# EAGLE design temperature_sensor (EAGLE 9.3.0)
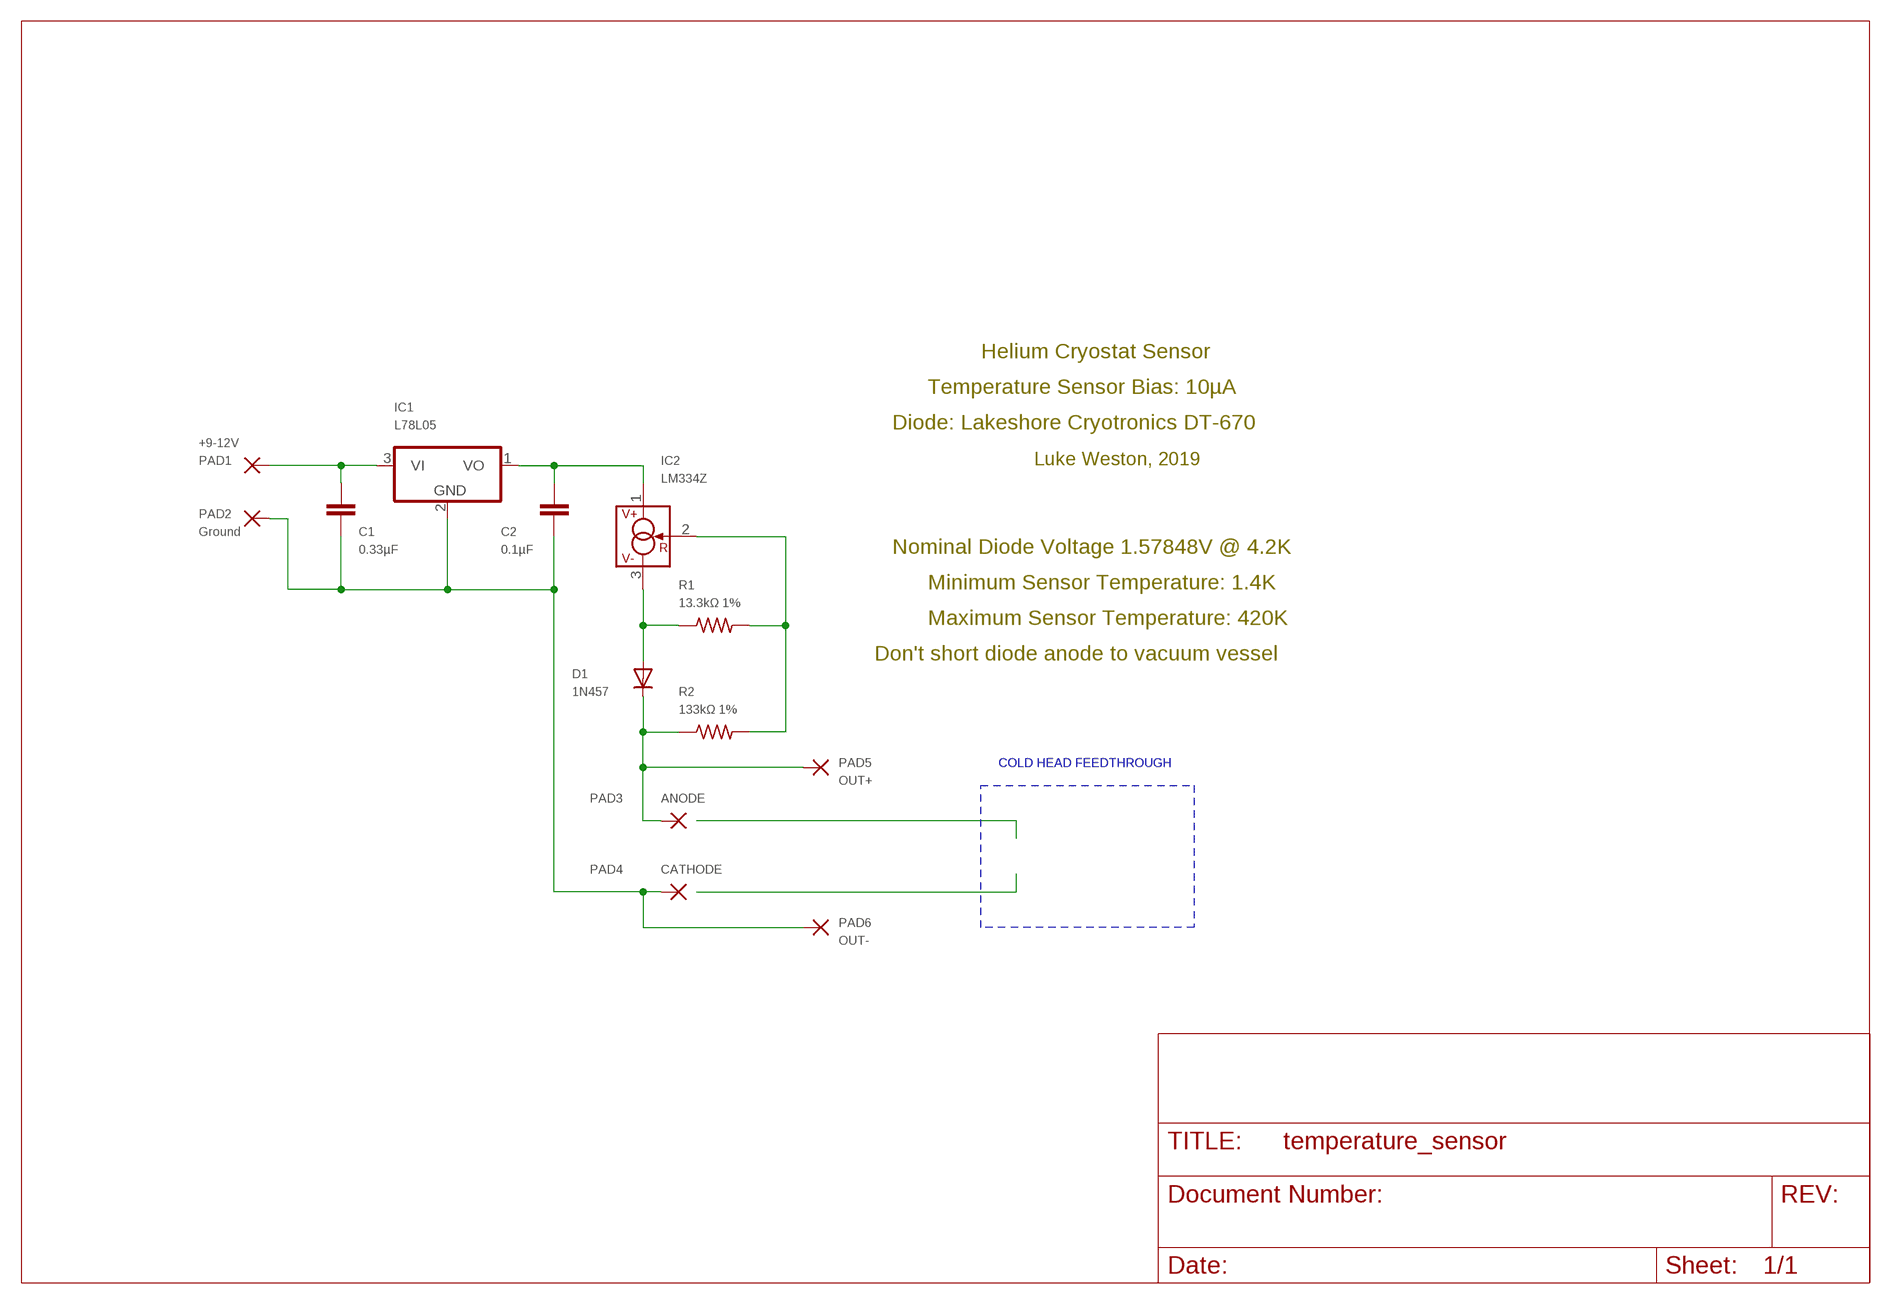
[diagram p0: schematic, sheet 1]

## Parts
C1  0.33µF  C-EU050-024X044  [C050-024X044]
C2  0.1µF  C-EU050-024X044  [C050-024X044]
D1  1N457  1N4004  [DO41-10]
IC1  L78L05  78L05Z  [TO92]
IC2  LM334Z  [TO92]
PAD1  +9-12V  2,54/1,0  [2,54/1,0]
PAD2  Ground  2,54/1,0  [2,54/1,0]
PAD3  ANODE  2,54/1,0  [2,54/1,0]
PAD4  CATHODE  2,54/1,0  [2,54/1,0]
PAD5  OUT+  2,54/1,0  [2,54/1,0]
PAD6  OUT-  2,54/1,0  [2,54/1,0]
R1  13.3kΩ 1%  R-US_0207/10  [0207/10]
R2  133kΩ 1%  R-US_0207/10  [0207/10]

## Nets
GND: C1.2 C2.2 IC1.2(GND) PAD2.1(P) PAD4.1(P) PAD6.1(P)
N$1: C1.1 IC1.3(VI) PAD1.1(P)
N$2: C2.1 IC1.1(VO) IC2.1(V+)
N$3: D1.C PAD3.1(P) PAD5.1(P) R2.1
N$4: D1.A IC2.3(V-) R1.1
N$5: IC2.2(R) R1.2 R2.2

## Buses
B$1

## Notes on the sheet
- Helium Cryostat Sensor
- Temperature Sensor Bias: 10µA
- Diode: Lakeshore Cryotronics DT-670
- Luke Weston, 2019
- Nominal Diode Voltage 1.57848V @ 4.2K
- Minimum Sensor Temperature: 1.4K
- Maximum Sensor Temperature: 420K
- Don't short diode anode to vacuum vessel
- COLD HEAD FEEDTHROUGH

## Library data of the parts
C1 C2 = rcl:C-EU: CAPACITOR, European symbol
D1 = diode:1N4004: DIODE general purpose rectifier, 1 A
IC1 = linear:78*: Positive VOLTAGE REGULATOR Source: http://cache.national.com/ds/LM/LM78L05.pdf http://www.fairchildsemi.com/ds/LM/LM7805.pdf
IC2 = linear:LM*34: 3-Terminal Adjustable Current Sources Source: www.national.com/pf/LM/LM334.html | LM134.pdf
PAD1-PAD6 = wirepad:2,54/1,0: THROUGH-HOLE PAD
R1 R2 = rcl:R-US_: RESISTOR, American symbol

## Board
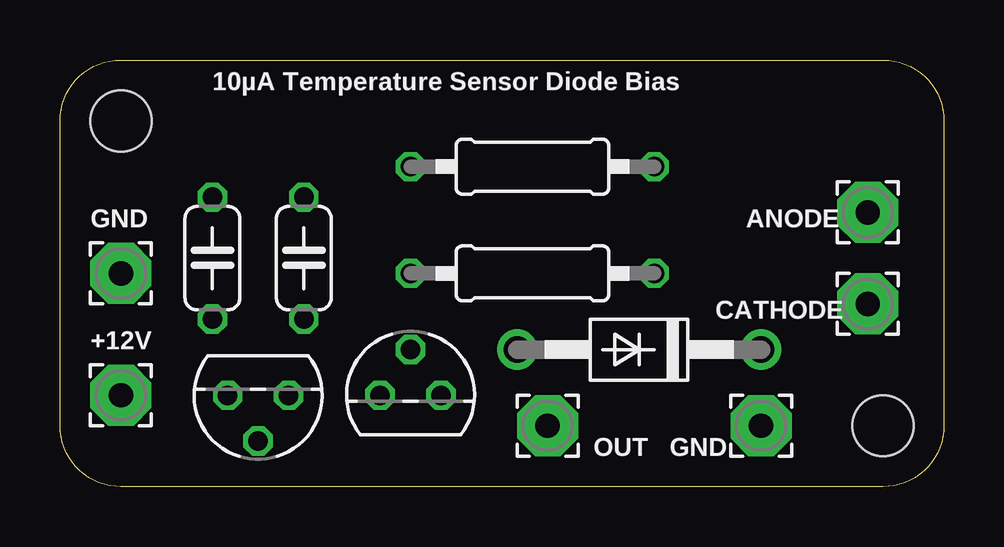
[diagram p1: board, top side]
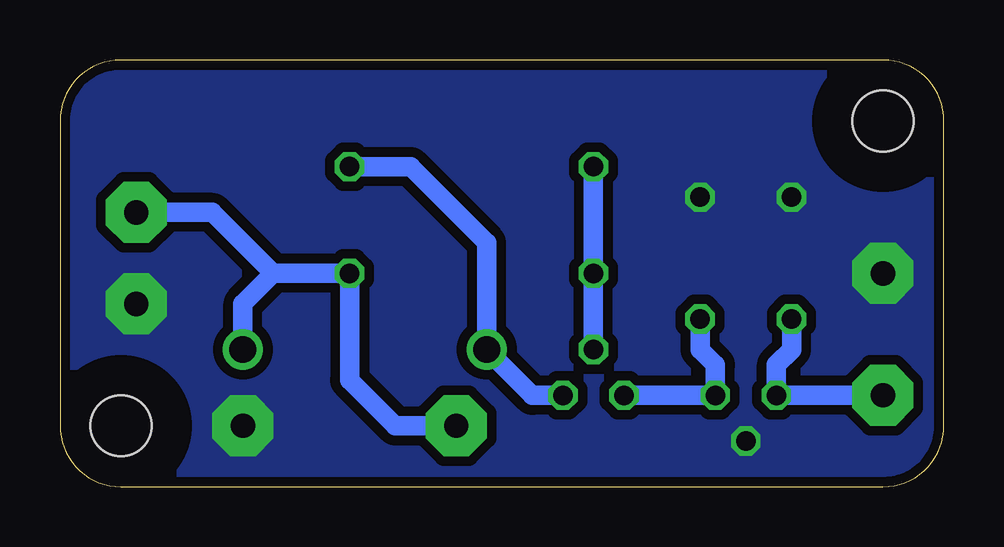
[diagram p2: board, bottom side, seen from below]

Size 36.83 x 17.78 mm. Coordinates in mm from the lower left corner, seen from the top.
Outline: 2.54,17.78 34.29,17.78 arc-90 36.83,15.24 36.83,2.54 arc-90 34.29,0 2.54,0 arc-90 0,2.54 0,15.24 arc-90 2.54,17.78
Copper layers (1*16): Top 0.035559375mm / dielectric 1.6mm / Bottom 0.035559375mm
Design rules "oshpark-2layer": minimum track width 6mil, minimum drill 10mil, track to track 6mil, track to pad 6mil, pad to pad 6mil, via to via 6mil, smd to smd 6mil, copper to edge 15mil, drill to drill 6mil, minimum pad ring 5mil, minimum via ring 5mil, stop-mask expansion 2.5mil, vias tented up to drill 0mil, thermal gap 10mil
Holes 2.54 mm at 2.54,15.24 34.29,2.54
tRestrict: area 0,12.7 to 5.1,17.8; area 31.8,0 to 36.8,5.1
bRestrict: area 0,12.7 to 5.1,17.8; area 31.8,0 to 36.8,5.1

### Footprints (pad centres in the part's own frame; a part is rotated, then mirrored left to right if it is on the bottom)
C050-024X044 = drill 0.813 octagon: 1 -2.54,0; 2 2.54,0
DO41-10 = drill 1.118: A 5.08,0; C -5.08,0
TO92 = drill 0.813 octagon: 1 -1.27,0; 2 0,1.905; 3 1.27,0
2,54/1,0 = drill 1.016 pad 2.54 octagon: 1 0,0
0207/10 = drill 0.813 octagon: 1 -5.08,0; 2 5.08,0

### Placement (x,y rotation side)
C1  6.35,9.53 90 top
C2  10.16,9.53 90 top
D1  24.13,5.71 180 top
IC1  8.26,3.81 180 top
IC2  14.61,3.81 0 top
PAD1  2.54,3.81 0 top
PAD2  2.54,8.89 0 top
PAD3  33.66,11.43 0 top
PAD4  33.66,7.62 0 top
PAD5  20.32,2.54 0 top
PAD6  29.21,2.54 0 top
R1  19.68,13.34 180 top
R2  19.68,8.89 180 top

### Tracks (layer width: path | path; a pad name or v marks a point on that pad's centre or on a via)
GND
  pour Bottom (isolate 0.406, no thermals): 0,17.78 36.83,17.78 36.83,0 0,0
N$1
  Bottom 0.813: C1.1 6.35,5.71 6.99,5.08 IC1.3 PAD1.1
N$2
  Bottom 0.813: C2.1 10.16,5.71 9.53,5.08 IC1.1 IC2.1
N$3
  Bottom 0.813: 27.94,8.89 R2.1 24.77,4.45 22.86,2.54 PAD5.1 | 27.94,8.89 30.48,11.43 PAD3.1 | D1.C 29.21,7.62 27.94,8.89
N$4
  Bottom 0.813: R1.1 22.22,13.34 19.05,10.16 D1.A 17.14,3.81 IC2.3
N$5
  Bottom 0.813: IC2.2 R2.2 R1.2

### Text on the board
tPlace: 10µA Temperature Sensor Diode Bias | GND | ANODE | CATHODE | +12V | OUT | GND